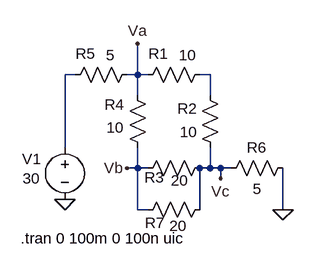
[diagram p0: schematic Resistive_Circuit.asc]
Resistive_Circuit.asc, the LTspice schematic file:
Version 4
SHEET 1 880 680
WIRE 64 64 48 64
WIRE 160 64 160 16
WIRE 160 64 144 64
WIRE 176 64 160 64
WIRE 272 64 256 64
WIRE 160 96 160 64
WIRE 272 96 272 64
WIRE 48 176 48 64
WIRE 160 208 160 176
WIRE 160 208 144 208
WIRE 176 208 160 208
WIRE 272 208 272 176
WIRE 272 208 256 208
WIRE 288 208 272 208
WIRE 304 208 288 208
WIRE 288 224 288 208
WIRE 160 272 160 208
WIRE 176 272 160 272
WIRE 256 272 256 208
WIRE 384 272 384 208
FLAG 384 272 0
FLAG 48 256 0
FLAG 160 16 Va
FLAG 144 208 Vb
FLAG 288 224 Vc
SYMBOL res 272 48 R90
WINDOW 0 -1 80 VBottom 2
WINDOW 3 -30 35 VTop 2
SYMATTR InstName R1
SYMATTR Value 10
SYMBOL res 288 192 R180
WINDOW 0 36 76 Left 2
WINDOW 3 36 40 Left 2
SYMATTR InstName R2
SYMATTR Value 10
SYMBOL res 160 224 R270
WINDOW 0 -14 26 VTop 2
WINDOW 3 13 65 VBottom 2
SYMATTR InstName R3
SYMATTR Value 20
SYMBOL res 144 80 R0
WINDOW 0 -35 30 Left 2
WINDOW 3 -32 65 Left 2
SYMATTR InstName R4
SYMATTR Value 10
SYMBOL res 160 48 R90
WINDOW 0 -1 80 VBottom 2
WINDOW 3 -30 42 VTop 2
SYMATTR InstName R5
SYMATTR Value 5
SYMBOL res 400 192 R90
WINDOW 0 0 56 VBottom 2
WINDOW 3 32 56 VTop 2
SYMATTR InstName R6
SYMATTR Value 5
SYMBOL res 160 288 R270
WINDOW 0 -20 27 VTop 2
WINDOW 3 7 63 VBottom 2
SYMATTR InstName R7
SYMATTR Value 20
SYMBOL voltage 48 160 R0
WINDOW 0 -66 34 Left 2
WINDOW 3 -65 64 Left 2
SYMATTR InstName V1
SYMATTR Value 30
TEXT -20 316 Left 2 !.tran 0 100m 0 100n uic

The netlist it stands for:
* Resistive_Circuit.asc
R1 N002 Va 10
R2 Vc N002 10
R3 Vb Vc 20
R4 Va Vb 10
R5 Va N001 5
R6 0 Vc 5
R7 Vb Vc 20
V1 N001 0 30
.tran 0 100m 0 100n uic
.backanno
.end